# Altium schematic sheet connectors.SchDoc
size A2
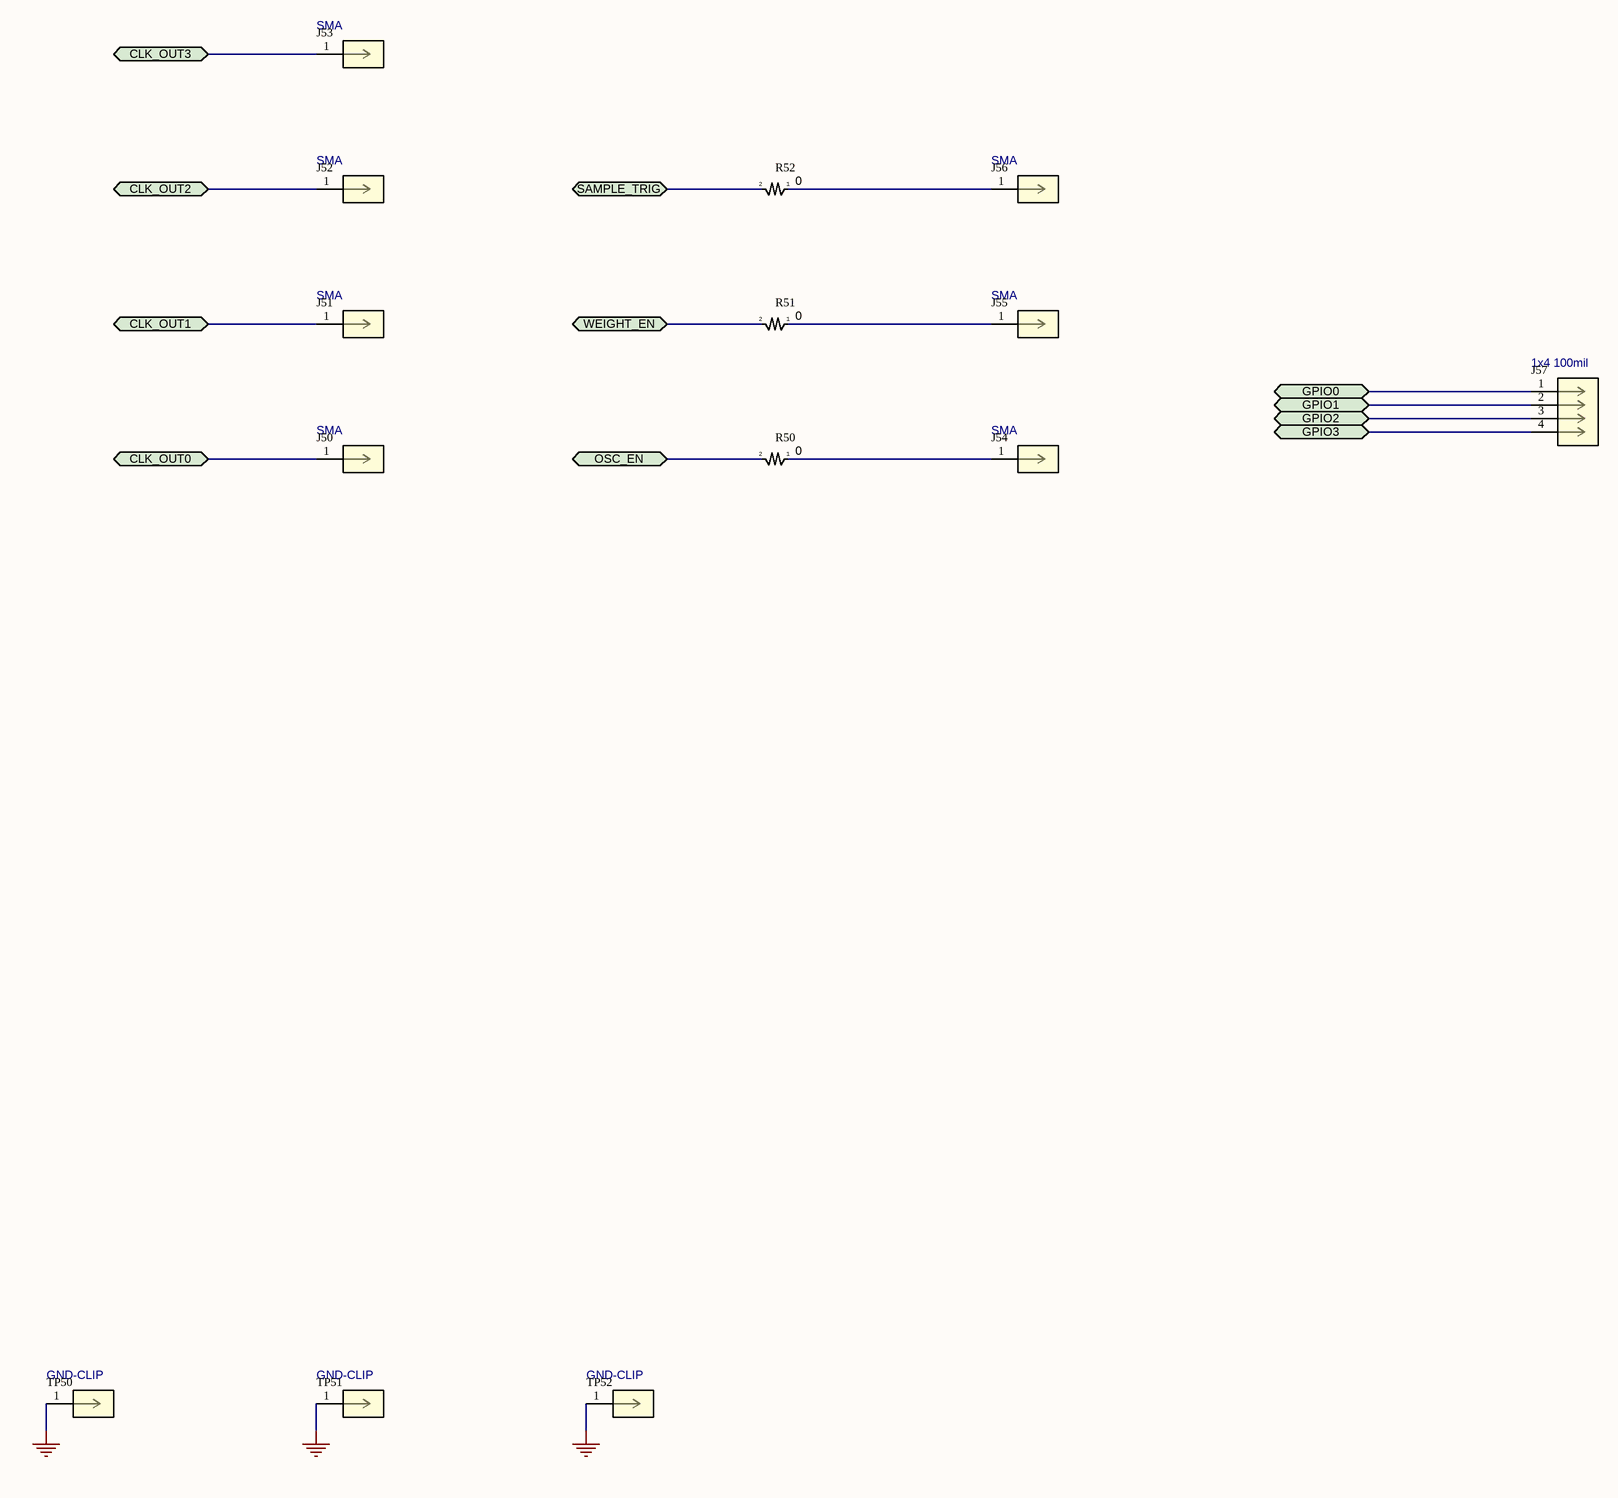
[diagram p0: connectors.SchDoc]

## Parts
J50  SMA
J51  SMA
J52  SMA
J53  SMA
J54  SMA
J55  SMA
J56  SMA
J57  1x4 100mil
R50  0
R51  0
R52  0
TP50  GND-CLIP
TP51  GND-CLIP
TP52  GND-CLIP

## Ports
CLK_OUT0 (bidir), CLK_OUT1 (bidir), CLK_OUT2 (bidir), CLK_OUT3 (bidir), GPIO0 (bidir), GPIO1 (bidir), GPIO2 (bidir), GPIO3 (bidir), OSC_EN (bidir), SAMPLE_TRIG (bidir), WEIGHT_EN (bidir)

## Nets
GND: TP50.1 TP51.1 TP52.1
CLK_OUT0: J50.1 ; port CLK_OUT0
CLK_OUT1: J51.1 ; port CLK_OUT1
CLK_OUT2: J52.1 ; port CLK_OUT2
CLK_OUT3: J53.1 ; port CLK_OUT3
GPIO0: J57.1 ; port GPIO0
GPIO1: J57.2 ; port GPIO1
GPIO2: J57.3 ; port GPIO2
GPIO3: J57.4 ; port GPIO3
OSC_EN: R50.2 ; port OSC_EN
SAMPLE_TRIG: R52.2 ; port SAMPLE_TRIG
WEIGHT_EN: R51.2 ; port WEIGHT_EN
NetJ54_1: J54.1 R50.1
NetJ55_1: J55.1 R51.1
NetJ56_1: J56.1 R52.1

## Library data of the parts
J50-J56 = HRMG-300-467B-1: Description; Manufacturer_Name: Hirose; Manufacturer_Part_Number: HRM(G)-300-467B-1; Copyright: Copyright (C) 2026 Ultra Librarian. All rights reserved.; RefDes: RefDes; Type: Type
J57 = TSW-104-05-G-S: No Description Available; Manufacturer_Name: Samtec Inc; Copyright: Copyright (C) 2026 Ultra Librarian. All rights reserved.; Manufacturer_Part_Number: TSW-104-05-G-S; RefDes: RefDes; Type: Type
R50-R52 = CRCW04020000Z0ED: D10/CRCW0402 0R0 ET7 e3; Manufacturer_Name: Vishay; Manufacturer_Part_Number: CRCW04020000Z0ED
TP50-TP52 = 5011: TEST POINT; PIN DIA=0.125IN; TOTAL LENGTH=0.445IN; BOARD HOLE=0.063IN; BLACK; PHOSPHOR BRONZE WIRE SILVER PLATE FINISH;; Manufacturer_Name: Keystone Electronics; Copyright: Copyright (C) 2026 Ultra Librarian. All rights reserved.; Manufacturer_Part_Number: 5011; RefDes: RefDes; Type: Type